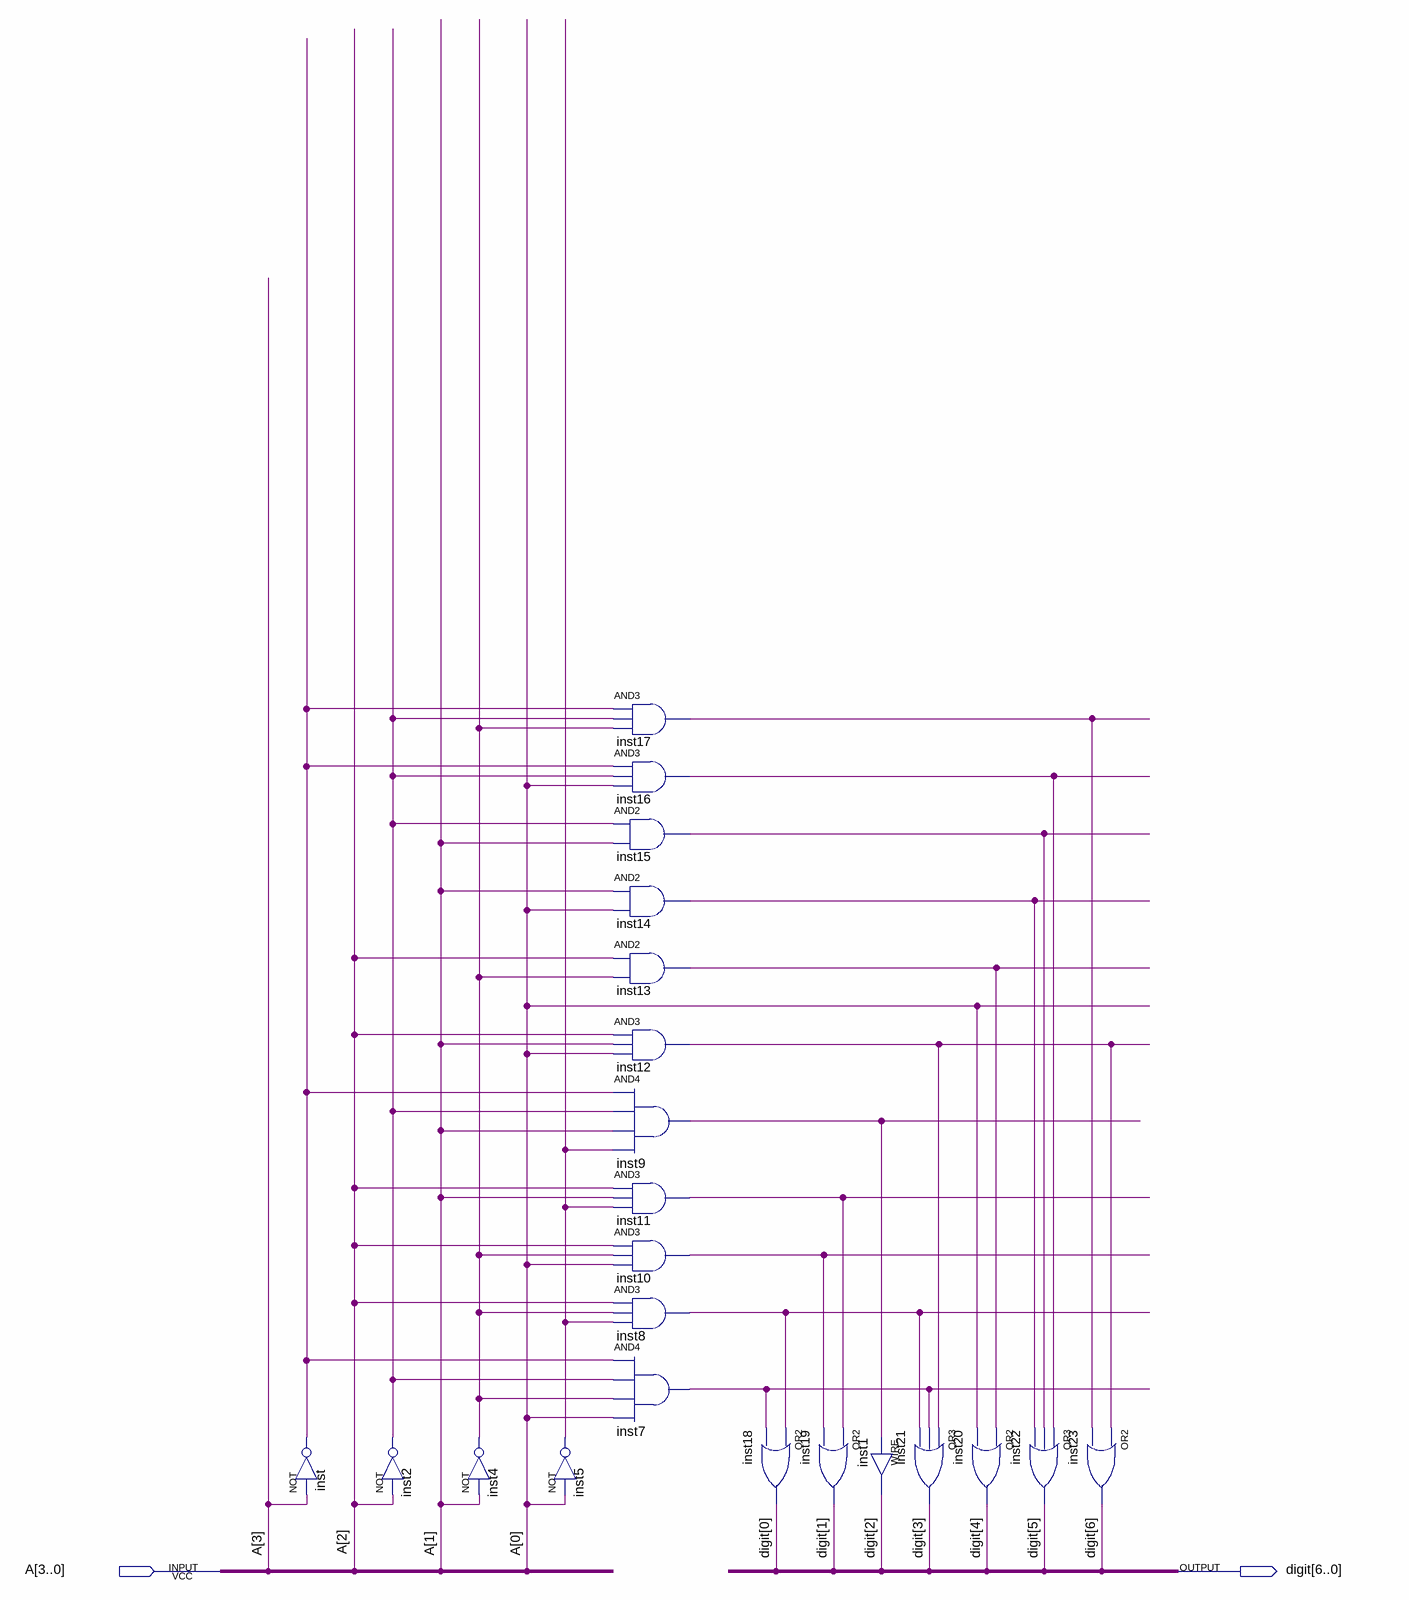
[diagram p0: schematic sheet]
// Quartus schematic decoder_7seg_digit.bdf as structural Verilog: 22 symbols, 2 pins
module decoder_7seg_digit (
  input  [3:0] A,
  output [6:0] digit
);

  wire inst2_out, inst4_out, inst5_out, inst7_out, inst8_out, inst9_out, inst10_out, inst11_out, inst12_out,
       inst13_out, inst14_out, inst15_out, inst16_out, inst17_out, inst_out;

  not inst (inst_out, A[3]);
  not inst2 (inst2_out, A[2]);
  not inst4 (inst4_out, A[1]);
  not inst5 (inst5_out, A[0]);
  and inst17 (inst17_out, inst_out, inst2_out, inst4_out);
  and inst16 (inst16_out, inst_out, inst2_out, A[0]);
  and inst15 (inst15_out, inst2_out, A[1]);
  and inst14 (inst14_out, A[1], A[0]);
  and inst13 (inst13_out, A[2], inst4_out);
  and inst12 (inst12_out, A[2], A[1], A[0]);
  and inst9 (inst9_out, inst_out, inst2_out, A[1], inst5_out);
  and inst11 (inst11_out, A[2], A[1], inst5_out);
  and inst10 (inst10_out, A[2], inst4_out, A[0]);
  and inst8 (inst8_out, A[2], inst4_out, inst5_out);
  and inst7 (inst7_out, inst_out, inst2_out, inst4_out, A[0]);
  or inst18 (digit[0], inst8_out, inst7_out);
  or inst19 (digit[1], inst11_out, inst10_out);
  assign digit[2] = inst9_out;  // WIRE inst1
  or inst21 (digit[3], inst12_out, inst7_out, inst8_out);
  or inst20 (digit[4], inst13_out, A[0]);
  or inst22 (digit[5], inst16_out, inst15_out, inst14_out);
  or inst23 (digit[6], inst12_out, inst17_out);
endmodule
